# Altium schematic sheet Comparators.SchDoc
size 406 x 304 mm; SheetNumber: 10; SheetTotal: 10
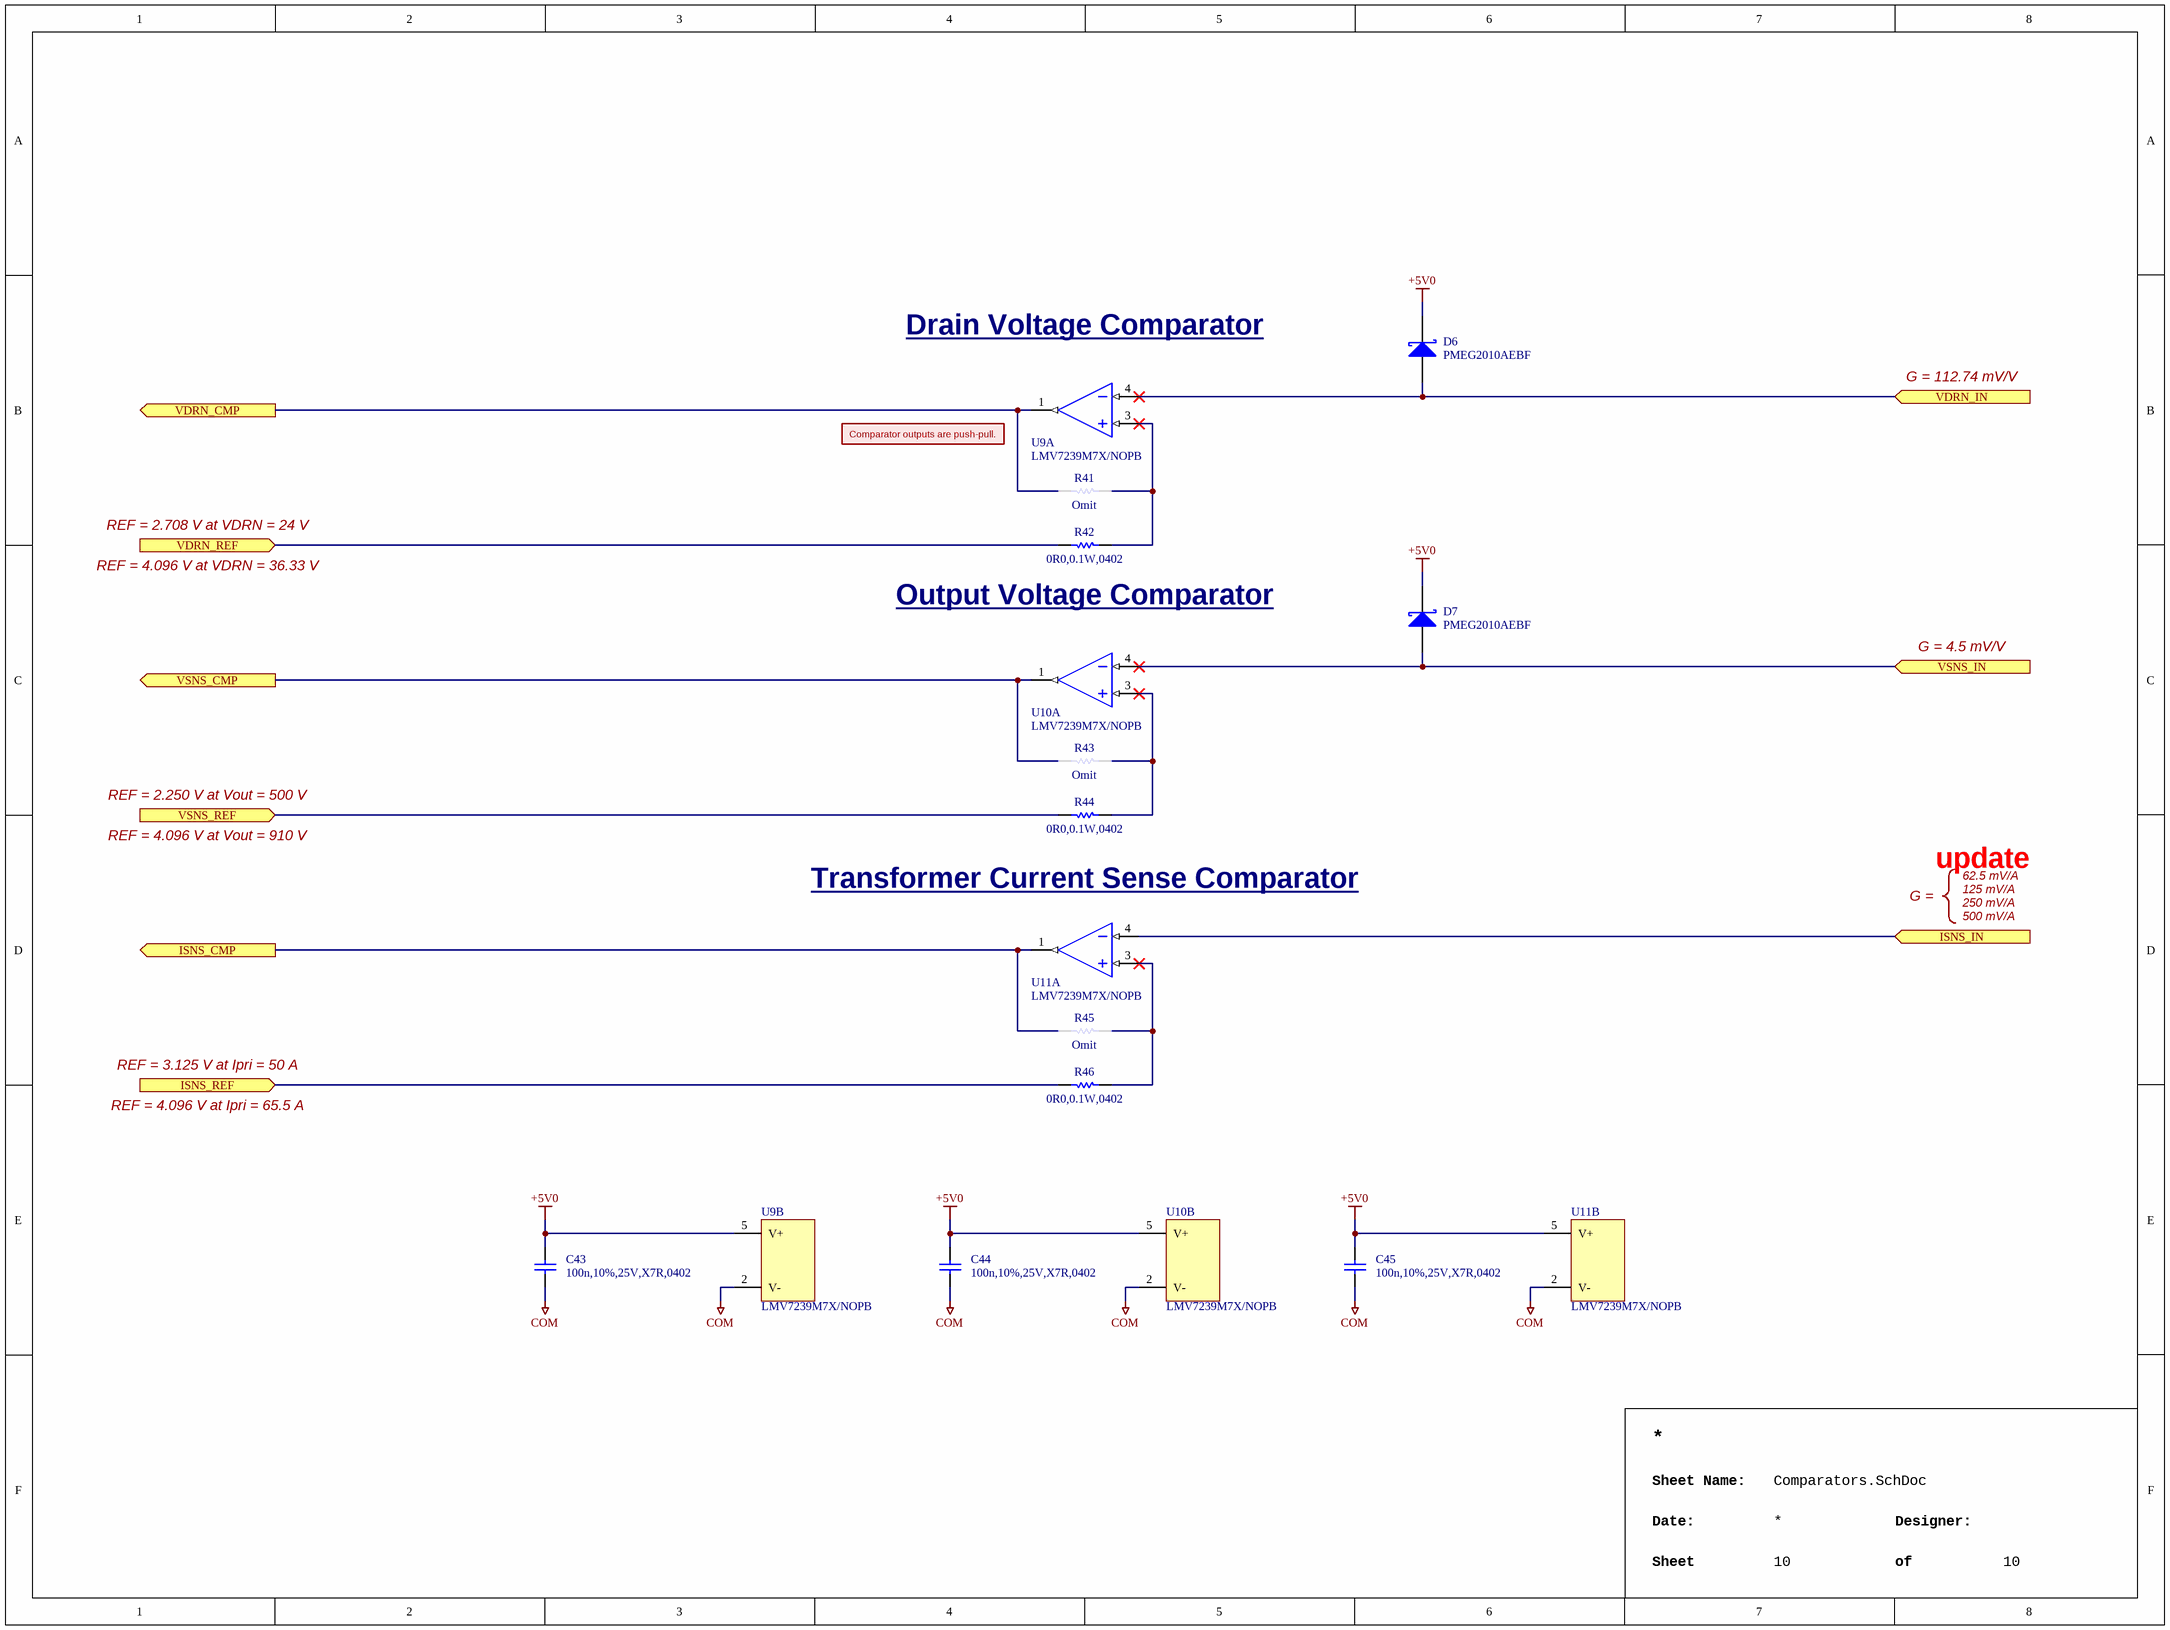
[diagram p0: Comparators.SchDoc]

## Parts
C43  100n,10%,25V,X7R,0402  [CAPC1005X06N]
C44  100n,10%,25V,X7R,0402  [CAPC1005X06N]
C45  100n,10%,25V,X7R,0402  [CAPC1005X06N]
D6  PMEG2010AEBF  [NEXPERIA_PKG_SOD523]
D7  PMEG2010AEBF  [NEXPERIA_PKG_SOD523]
R41  Omit  [RESC1005X04N]  (no BOM)
R42  0R0,0.1W,0402  [RESC1005X04N]
R43  Omit  [RESC1005X04N]  (no BOM)
R44  0R0,0.1W,0402  [RESC1005X04N]
R45  Omit  [RESC1005X04N]  (no BOM)
R46  0R0,0.1W,0402  [RESC1005X04N]
U9  LMV7239M7X/NOPB  [SOTFL65P210X110-6N]  (parts A,B of 2)
U10  LMV7239M7X/NOPB  [SOTFL65P210X110-6N]  (parts A,B of 2)
U11  LMV7239M7X/NOPB  [SOTFL65P210X110-6N]  (parts A,B of 2)

## Ports
ISNS_CMP (out), ISNS_IN (in), ISNS_REF (in), VDRN_CMP (out), VDRN_IN (in), VDRN_REF (in), VSNS_CMP (out), VSNS_IN (in), VSNS_REF (in)

## Nets
+5V0: C43.2 C44.2 C45.2 D6.1(K) D7.1(K) U9.5(V+) U10.5(V+) U11.5(V+)
COM: C43.1 C44.1 C45.1 U9.2(V-) U10.2(V-) U11.2(V-)
ISNS_CMP: R45.1 U11.1(VOUT) ; port ISNS_CMP
ISNS_IN: U11.4(IN-) ; port ISNS_IN
ISNS_REF: R46.1 ; port ISNS_REF
VDRN_CMP: R41.1 U9.1(VOUT) ; port VDRN_CMP
VDRN_IN: D6.2(A) U9.4(IN-) ; port VDRN_IN
VDRN_REF: R42.1 ; port VDRN_REF
VSNS_CMP: R43.1 U10.1(VOUT) ; port VSNS_CMP
VSNS_IN: D7.2(A) U10.4(IN-) ; port VSNS_IN
VSNS_REF: R44.1 ; port VSNS_REF
NetR41_2: R41.2 R42.2 U9.3(IN+)
NetR43_2: R43.2 R44.2 U10.3(IN+)
NetR45_2: R45.2 R46.2 U11.3(IN+)

## Notes on the sheet
- www
- Drain Voltage Comparator
- Comparator outputs are push-pull.
- G = 112.74 mV/V
- REF = 2.708 V at VDRN = 24 V
- REF = 4.096 V at VDRN = 36.33 V
- Output Voltage Comparator
- G = 4.5 mV/V
- REF = 2.250 V at Vout = 500 V
- REF = 4.096 V at Vout = 910 V
- Transformer Current Sense Comparator
- G =
- update
- 250 mV/A
- 125 mV/A
- 62.5 mV/A
- 500 mV/A
- REF = 3.125 V at Ipri = 50 A
- REF = 4.096 V at Ipri = 65.5 A
- Sheet Name:
- Date:
- Sheet
- Designer:
- of

## Library data of the parts
C43-C45 = CAP,Cer,100nF,10%,25V,X7R,0402: 0.1ï¿½F ï¿½10% 25V Ceramic Capacitor X7R 0402 (1005 Metric); Manufacturer 1: Murata Electronics; Manufacturer 1 Part Number: GRM155R71E104KE14J; Vendor 1 Part Number: 490-14603-1-ND; Vendor 1: DigiKey; Value: 100nF; Part Name: CAP,Cer,100nF,10%,25V,X7R,0402; CreatedBy: Judd Foster; HelpURL: https://search.murata.co.jp/Ceramy/image/img/A01X/G101/ENG/GRM155R71E104KE14-01.pdf
D6 D7 = DIODE,Schottky,20V,1A,SOD523: Diode 20 V 1A Surface Mount SOD-523; Manufacturer 1: Nexperia USA Inc.; Vendor 1 Part Number: 1727-8539-1-ND; Vendor 1: DigiKey; Part Name: DIODE,Schottky,20V,1A,SOD523; CreatedBy: Judd Foster; HelpURL: https://assets.nexperia.com/documents/data-sheet/PMEG2010AEB.pdf; Manufacturer 1 Part Number: PMEG2010AEBF
R41 R43 R45 = RES,Omit,0402: Part Name: RES,Omit,0402; CreatedBy: Judd Foster; HelpURL: N/A; Manufacturer 1: N/A; Manufacturer 1 Part Number: N/A; Vendor 1: N/A; Vendor 1 Part Number: N/A; Value: Omit
R42 R44 R46 = RES,0R0,0.1W,0402: 0 Ohms Jumper 0.1W, 1/10W Chip Resistor 0402 (1005 Metric) Automotive AEC-Q200 Thick Film; Manufacturer 1: Panasonic Electronic Components; Manufacturer 1 Part Number: ERJ-2GE0R00X; Vendor 1 Part Number: P0.0JCT-ND; Vendor 1: Digikey; Value: 0R; Part Name: RES,0R0,0.1W,0402; CreatedBy: Judd Foster; HelpURL: https://industrial.panasonic.com/cdbs/www-data/pdf/RDA0000/AOA0000C301.pdf
U9-U11 = LMV7239M7X/NOPB: Comparator General Purpose Push-Pull SC-70-5; Manufacturer 1: Texas Instruments; Vendor 1 Part Number: 296-35198-1-ND; Vendor 1: Digikey; Part Name: LMV7239M7X/NOPB; CreatedBy: Judd Foster; HelpURL: https://www.ti.com/general/docs/suppproductinfo.tsp?distId=10&gotoUrl=https%3A%2F%2Fwww.ti.com%2Flit%2Fgpn%2Flmv7235; Manufacturer 1 Part Number: LMV7239M7X/NOPB